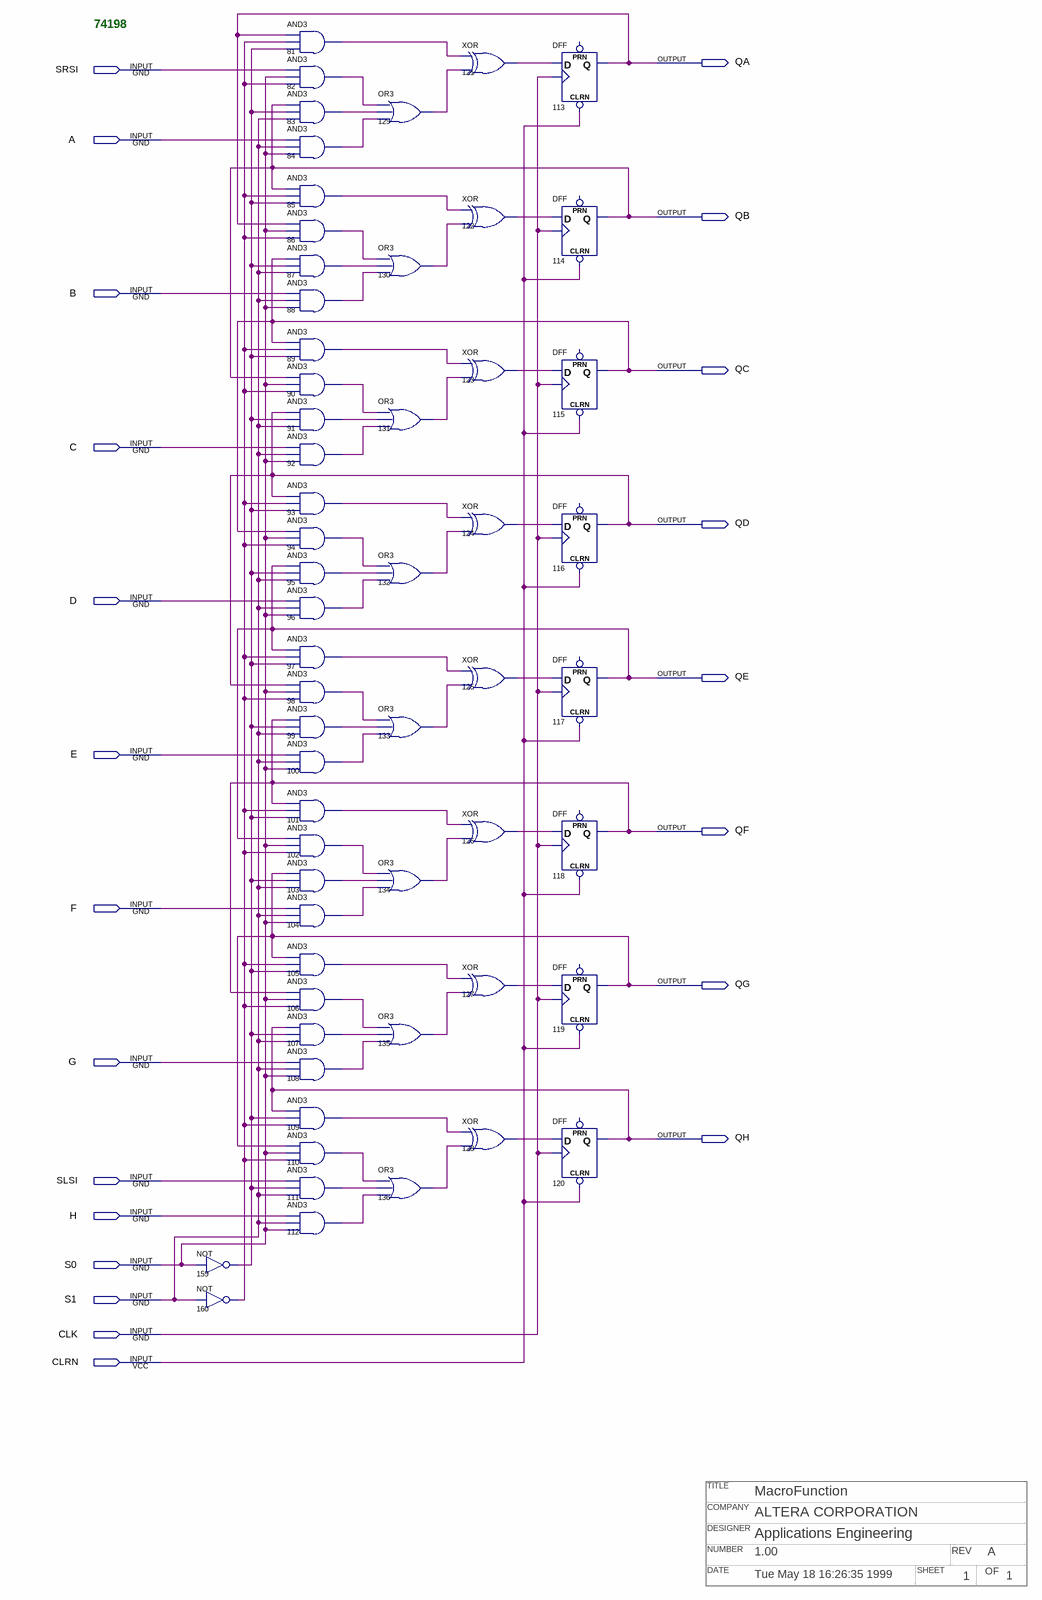
[diagram p0: schematic sheet]
// Quartus schematic 74198.bdf as structural Verilog: 58 symbols, 22 pins
// Title block: TITLE: MacroFunction; COMPANY: ALTERA CORPORATION; DESIGNER: Applications Engineering; NUMBER: 1.00; REV: A; DATE: Tue May 18 16:26:35 1999; SHEET: 1; OF: 1
module \74198  (
  input  SRSI,
  input  A,
  input  B,
  input  C,
  input  D,
  input  E,
  input  F,
  input  G,
  input  SLSI,
  input  H,
  input  S0,
  input  S1,
  input  CLK,
  input  CLRN,
  output QA,
  output QB,
  output QC,
  output QD,
  output QE,
  output QF,
  output QG,
  output QH
);

  wire n81_out, n82_out, n83_out, n84_out, n85_out, n86_out, n87_out, n88_out, n89_out, n90_out, n91_out,
       n92_out, n93_out, n94_out, n95_out, n96_out, n97_out, n98_out, n99_out, n100_out, n101_out, n102_out,
       n103_out, n104_out, n105_out, n106_out, n107_out, n108_out, n109_out, n110_out, n111_out, n112_out,
       n121_out, n122_out, n123_out, n124_out, n125_out, n126_out, n127_out, n128_out, n129_out, n130_out,
       n131_out, n132_out, n133_out, n134_out, n135_out, n136_out, n159_out, n160_out;

  not u_159 (n159_out, S0);
  not u_160 (n160_out, S1);
  and u_81 (n81_out, QA, n160_out, n159_out);
  and u_82 (n82_out, SRSI, S0, n160_out);
  and u_83 (n83_out, QB, n159_out, S1);
  and u_84 (n84_out, A, S1, S0);
  and u_85 (n85_out, QB, n160_out, n159_out);
  and u_86 (n86_out, QA, S0, n160_out);
  and u_87 (n87_out, QC, n159_out, S1);
  and u_88 (n88_out, B, S1, S0);
  and u_89 (n89_out, QC, n160_out, n159_out);
  and u_90 (n90_out, QB, S0, n160_out);
  and u_91 (n91_out, QD, n159_out, S1);
  and u_92 (n92_out, C, S1, S0);
  and u_93 (n93_out, QD, n160_out, n159_out);
  and u_94 (n94_out, QC, S0, n160_out);
  and u_95 (n95_out, QE, n159_out, S1);
  and u_96 (n96_out, D, S1, S0);
  and u_97 (n97_out, QE, n160_out, n159_out);
  and u_98 (n98_out, QD, S0, n160_out);
  and u_99 (n99_out, QF, n159_out, S1);
  and u_100 (n100_out, E, S1, S0);
  and u_101 (n101_out, QF, n160_out, n159_out);
  and u_102 (n102_out, QE, S0, n160_out);
  and u_103 (n103_out, QG, n159_out, S1);
  and u_104 (n104_out, F, S1, S0);
  and u_105 (n105_out, QG, n160_out, n159_out);
  and u_106 (n106_out, QF, S0, n160_out);
  and u_107 (n107_out, QH, n159_out, S1);
  and u_108 (n108_out, G, S1, S0);
  and u_109 (n109_out, QH, n159_out, n160_out);
  and u_110 (n110_out, QG, S0, n160_out);
  and u_111 (n111_out, SLSI, n159_out, S1);
  and u_112 (n112_out, H, S1, S0);
  or u_129 (n129_out, n82_out, n83_out, n84_out);
  or u_130 (n130_out, n86_out, n87_out, n88_out);
  or u_131 (n131_out, n90_out, n91_out, n92_out);
  or u_132 (n132_out, n94_out, n95_out, n96_out);
  or u_133 (n133_out, n98_out, n99_out, n100_out);
  or u_134 (n134_out, n102_out, n103_out, n104_out);
  or u_135 (n135_out, n106_out, n107_out, n108_out);
  or u_136 (n136_out, n110_out, n111_out, n112_out);
  xor u_121 (n121_out, n81_out, n129_out);
  xor u_122 (n122_out, n85_out, n130_out);
  xor u_123 (n123_out, n89_out, n131_out);
  xor u_124 (n124_out, n93_out, n132_out);
  xor u_125 (n125_out, n97_out, n133_out);
  xor u_126 (n126_out, n101_out, n134_out);
  xor u_127 (n127_out, n105_out, n135_out);
  xor u_128 (n128_out, n109_out, n136_out);
  DFF u_113 (.CLRN(CLRN), .CLK(CLK), .D(n121_out), .Q(QA));  // open: PRN
  DFF u_114 (.CLRN(CLRN), .CLK(CLK), .D(n122_out), .Q(QB));  // open: PRN
  DFF u_115 (.CLRN(CLRN), .CLK(CLK), .D(n123_out), .Q(QC));  // open: PRN
  DFF u_116 (.CLRN(CLRN), .CLK(CLK), .D(n124_out), .Q(QD));  // open: PRN
  DFF u_117 (.CLRN(CLRN), .CLK(CLK), .D(n125_out), .Q(QE));  // open: PRN
  DFF u_118 (.CLRN(CLRN), .CLK(CLK), .D(n126_out), .Q(QF));  // open: PRN
  DFF u_119 (.CLRN(CLRN), .CLK(CLK), .D(n127_out), .Q(QG));  // open: PRN
  DFF u_120 (.CLRN(CLRN), .CLK(CLK), .D(n128_out), .Q(QH));  // open: PRN

  // Notes on the sheet:
  //   74198
endmodule
